# EAGLE schematic singleTransistor (EAGLE 7.4.0)
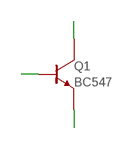
[diagram p0: schematic, sheet 1]

## Parts
Q1  BC547  TRANSISTOR-NPN-GENERICDEFAULT-SOT23-BEC  [SOT23]

## Nets
BASE: Q1.P$1(BASE)
COLLECTOR: Q1.P$3(COLLECTOR)
EMITTER: Q1.P$2(EMITTER)

## Library data of the parts
Q1 = p.peter-scoville.tests:TRANSISTOR-NPN-GENERIC; SV_SPICE_MODEL: NPN (); SV_SPICE_ORDER: COLLECTOR;BASE;EMITTER; SV_SPICE_PREFIX: Q